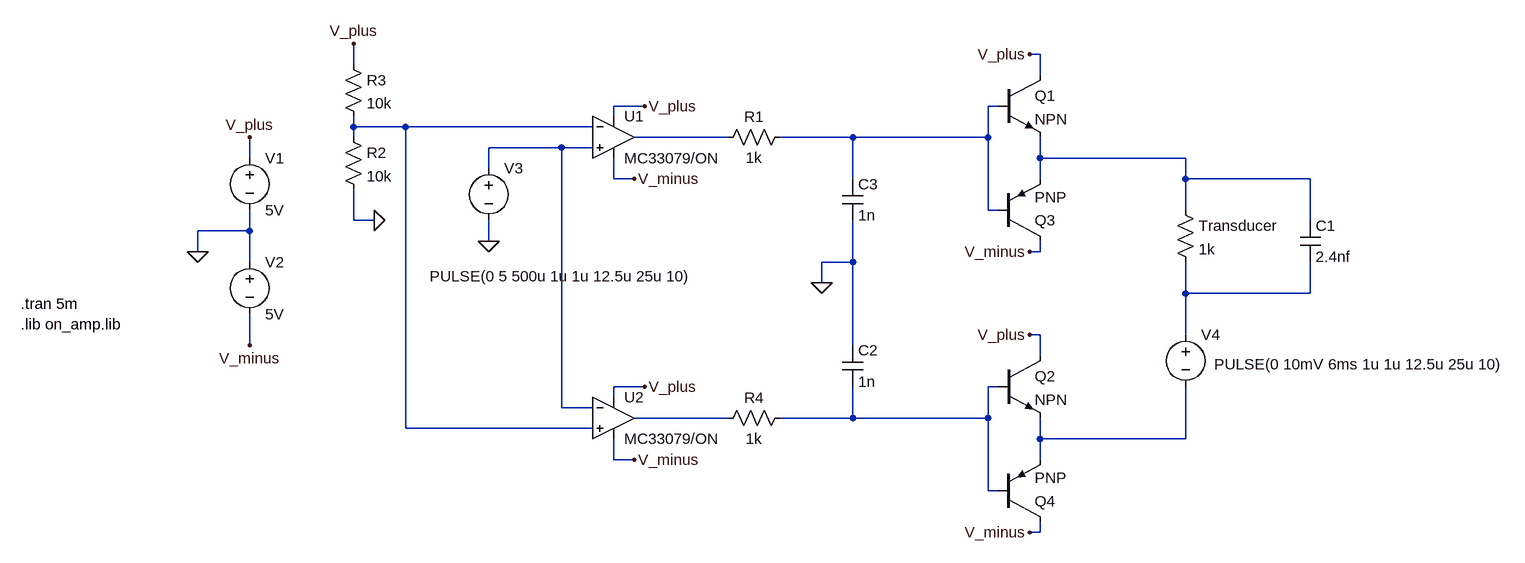
[diagram p0: schematic push-pull_send.asc]
push-pull_send.asc, the LTspice schematic file:
Version 4
SHEET 1 880 732
WIRE 64 -64 48 -64
WIRE -992 -48 -992 -80
WIRE 64 -32 64 -64
WIRE -544 16 -592 16
WIRE 0 16 -16 16
WIRE -592 32 -592 16
WIRE -992 48 -992 32
WIRE -912 48 -992 48
WIRE -624 48 -912 48
WIRE -992 64 -992 48
WIRE -416 64 -560 64
WIRE -224 64 -336 64
WIRE -16 64 -16 16
WIRE -16 64 -224 64
WIRE -672 80 -784 80
WIRE -624 80 -672 80
WIRE -1152 96 -1152 64
WIRE 64 96 64 64
WIRE 288 96 64 96
WIRE -784 112 -784 80
WIRE -592 128 -592 96
WIRE -560 128 -592 128
WIRE -224 128 -224 64
WIRE 64 128 64 96
WIRE 288 128 288 96
WIRE 480 128 288 128
WIRE -16 176 -16 64
WIRE 0 176 -16 176
WIRE 288 176 288 128
WIRE -992 192 -992 144
WIRE -960 192 -992 192
WIRE 480 192 480 128
WIRE -1152 208 -1152 176
WIRE -1152 208 -1232 208
WIRE -784 224 -784 192
WIRE -1232 240 -1232 208
WIRE 64 240 64 224
WIRE 64 240 48 240
WIRE -1152 256 -1152 208
WIRE -224 256 -224 192
WIRE -224 256 -272 256
WIRE -272 288 -272 256
WIRE 288 304 288 256
WIRE 480 304 480 256
WIRE 480 304 288 304
WIRE 64 368 48 368
WIRE 288 368 288 304
WIRE -1152 384 -1152 336
WIRE -224 384 -224 256
WIRE 64 400 64 368
WIRE -544 448 -592 448
WIRE 0 448 -16 448
WIRE -592 464 -592 448
WIRE -672 480 -672 80
WIRE -624 480 -672 480
WIRE -416 496 -560 496
WIRE -224 496 -224 448
WIRE -224 496 -336 496
WIRE -16 496 -16 448
WIRE -16 496 -224 496
WIRE -912 512 -912 48
WIRE -624 512 -912 512
WIRE 64 528 64 496
WIRE 288 528 288 448
WIRE 288 528 64 528
WIRE -592 560 -592 528
WIRE -560 560 -592 560
WIRE 64 560 64 528
WIRE -16 608 -16 496
WIRE 0 608 -16 608
WIRE 64 672 64 656
WIRE 64 672 48 672
FLAG -1232 240 0
FLAG -1152 64 V_plus
FLAG -1152 384 V_minus
FLAG -560 128 V_minus
FLAG -544 16 V_plus
FLAG -784 224 0
FLAG -960 192 0
FLAG -992 -80 V_plus
FLAG 48 240 V_minus
FLAG 48 -64 V_plus
FLAG -560 560 V_minus
FLAG -544 448 V_plus
FLAG 48 672 V_minus
FLAG 48 368 V_plus
FLAG -272 288 0
SYMBOL Opamps\\opamp2 -592 0 R0
SYMATTR InstName U1
SYMATTR Value MC33079/ON
SYMBOL voltage -1152 80 R0
WINDOW 123 0 0 Left 0
WINDOW 39 0 0 Left 0
SYMATTR InstName V1
SYMATTR Value 5V
SYMBOL voltage -1152 240 R0
WINDOW 123 0 0 Left 0
WINDOW 39 0 0 Left 0
SYMATTR InstName V2
SYMATTR Value 5V
SYMBOL voltage -784 96 R0
WINDOW 123 0 0 Left 0
WINDOW 39 0 0 Left 0
WINDOW 3 -91 182 Left 0
SYMATTR Value PULSE(0 5 500u 1u 1u 12.5u 25u 10)
SYMATTR InstName V3
SYMBOL res 272 160 R0
SYMATTR InstName Transducer
SYMATTR Value 1k
SYMBOL res -1008 48 R0
SYMATTR InstName R2
SYMATTR Value 10k
SYMBOL res -1008 -64 R0
SYMATTR InstName R3
SYMATTR Value 10k
SYMBOL voltage 288 352 R0
WINDOW 123 0 0 Left 0
WINDOW 39 0 0 Left 0
WINDOW 3 44 61 Left 0
SYMATTR Value PULSE(0 10mV 6ms 1u 1u 12.5u 25u 10)
SYMATTR InstName V4
SYMBOL Opamps\\opamp2 -592 432 R0
SYMATTR InstName U2
SYMATTR Value MC33079/ON
SYMBOL npn 0 -32 R0
SYMATTR InstName Q1
SYMBOL npn 0 400 R0
SYMATTR InstName Q2
SYMBOL pnp 0 224 M180
SYMATTR InstName Q3
SYMBOL pnp 0 656 M180
SYMATTR InstName Q4
SYMBOL cap 464 192 R0
SYMATTR InstName C1
SYMATTR Value 2.4nf
SYMBOL res -320 48 R90
WINDOW 0 0 56 VBottom 0
WINDOW 3 32 56 VTop 0
SYMATTR InstName R1
SYMATTR Value 1k
SYMBOL res -320 480 R90
WINDOW 0 0 56 VBottom 0
WINDOW 3 32 56 VTop 0
SYMATTR InstName R4
SYMATTR Value 1k
SYMBOL cap -240 384 R0
SYMATTR InstName C2
SYMATTR Value 1n
SYMBOL cap -240 128 R0
SYMATTR InstName C3
SYMATTR Value 1n
TEXT -1504 352 Left 0 !.lib on_amp.lib
TEXT -1504 320 Left 0 !.tran 5m

The netlist it stands for:
* push-pull_send.asc
XU1 N004 N002 V_plus V_minus N003 MC33079/ON  ; pins In+ In- V+ V- OUT
V1 V_plus 0 5V
V2 0 V_minus 5V
V3 N004 0 PULSE(0 5 500u 1u 1u 12.5u 25u 10)
R§Transducer N005 N006 1k
R2 N002 0 10k
R3 V_plus N002 10k
V4 N006 N009 PULSE(0 10mV 6ms 1u 1u 12.5u 25u 10)
XU2 N002 N004 V_plus V_minus N008 MC33079/ON  ; pins In+ In- V+ V- OUT
Q1 V_plus N001 N005 0 NPN
Q2 V_plus N007 N009 0 NPN
Q3 V_minus N001 N005 0 PNP
Q4 V_minus N007 N009 0 PNP
C1 N005 N006 2.4nf
R1 N001 N003 1k
R4 N007 N008 1k
C2 0 N007 1n
C3 N001 0 1n
.model NPN NPN
.model PNP PNP
.lib standard.bjt
.lib on_amp.lib
.tran 5m
.backanno
.end